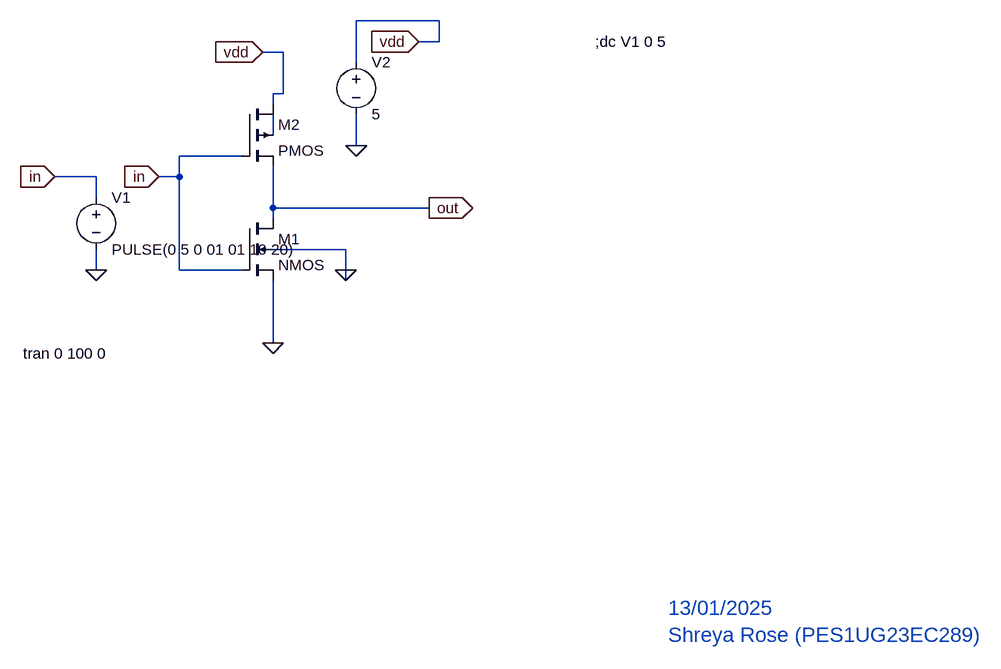
[diagram p0: schematic inverter.asc]
inverter.asc, the LTspice schematic file:
Version 4
SHEET 1 1176 788
WIRE 320 -176 192 -176
WIRE 320 -144 320 -176
WIRE 320 -144 288 -144
WIRE 80 -128 48 -128
WIRE 192 -112 192 -176
WIRE 80 -64 80 -128
WIRE 80 -64 64 -64
WIRE 64 -48 64 -64
WIRE 64 0 64 -32
WIRE 192 16 192 -32
WIRE 16 32 -80 32
WIRE -208 64 -272 64
WIRE -80 64 -80 32
WIRE -80 64 -112 64
WIRE -208 96 -208 64
WIRE 64 112 64 48
WIRE 304 112 64 112
WIRE 64 128 64 112
WIRE 176 176 64 176
WIRE -208 208 -208 176
WIRE -80 208 -80 64
WIRE 16 208 -80 208
WIRE 176 208 176 176
WIRE 176 224 176 208
WIRE 64 320 64 224
FLAG 64 320 0
FLAG 192 16 0
FLAG -208 208 0
FLAG -272 64 in
IOPIN -272 64 In
FLAG 288 -144 vdd
IOPIN 288 -144 In
FLAG 48 -128 vdd
IOPIN 48 -128 In
FLAG -112 64 in
IOPIN -112 64 In
FLAG 304 112 out
IOPIN 304 112 Out
FLAG 176 208 0
SYMBOL voltage -208 80 R0
WINDOW 123 0 0 Left 0
WINDOW 39 0 0 Left 0
SYMATTR InstName V1
SYMATTR Value PULSE(0 5 0 01 01 10 20)
SYMBOL pmos4 16 -48 R0
SYMATTR InstName M2
SYMBOL nmos4 16 128 R0
SYMATTR InstName M1
SYMBOL voltage 192 -128 R0
WINDOW 123 0 0 Left 0
WINDOW 39 0 0 Left 0
SYMATTR InstName V2
SYMATTR Value 5
TEXT 672 728 Left 3 ;13/01/2025\nShreya Rose (PES1UG23EC289)
TEXT 560 -144 Left 2 !;dc V1 0 5
TEXT -320 336 Left 2 !tran 0 100 0

The netlist it stands for:
* inverter.asc
V1 in 0 PULSE(0 5 0 01 01 10 20)
M2 vdd in out N001 PMOS
M1 out in 0 0 NMOS
V2 vdd 0 5
.model NMOS NMOS
.model PMOS PMOS
.lib standard.mos
* 13/01/2025
* Shreya Rose (PES1UG23EC289)
;dc V1 0 5
tran 0 100 0
.backanno
.end